# EAGLE design Power (EAGLE 9.1.0)
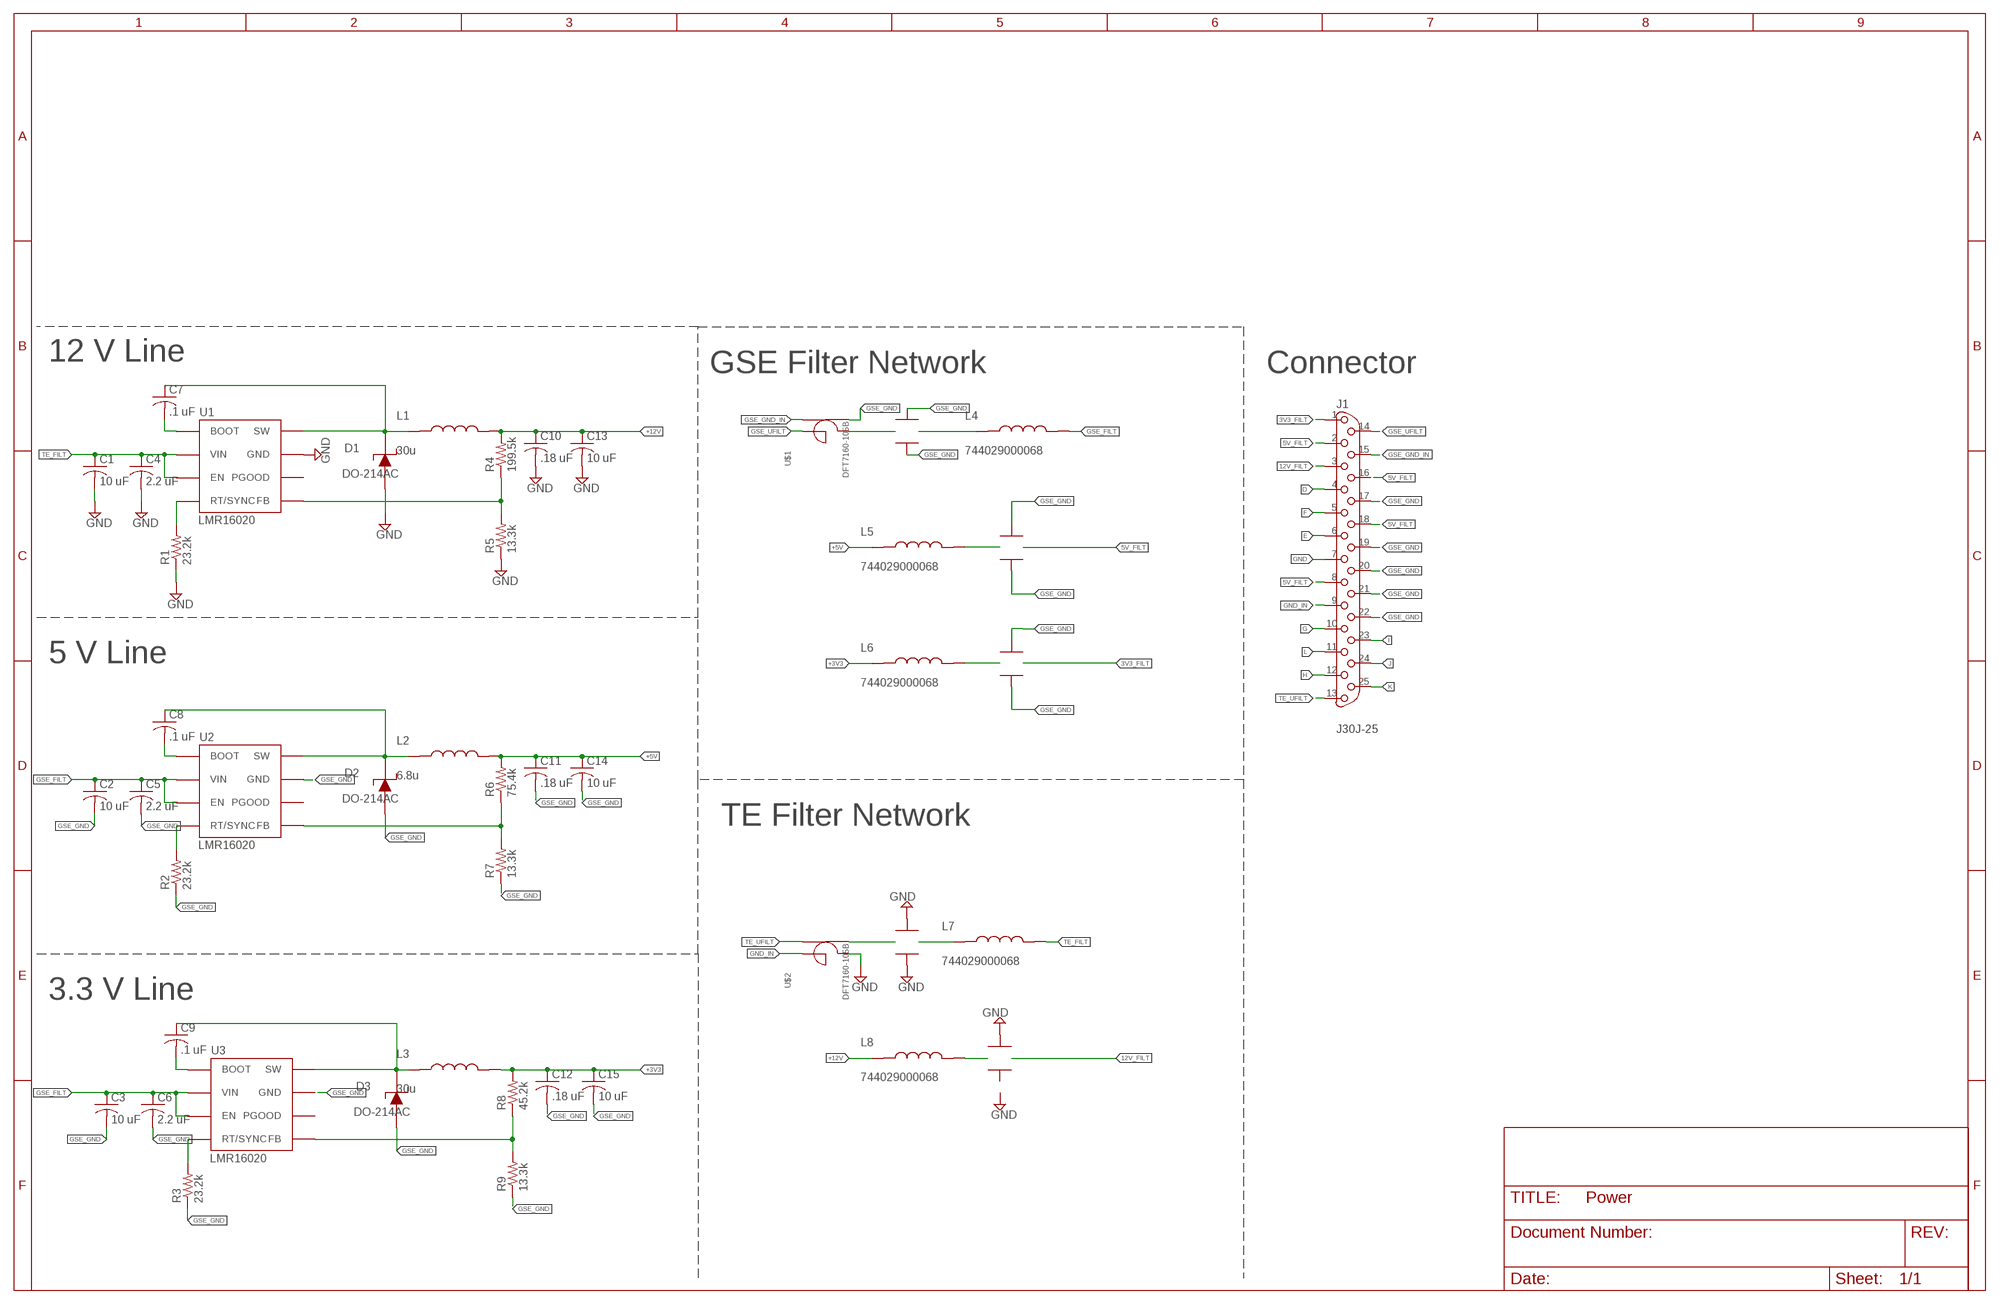
[diagram p0: schematic, sheet 1]

## Parts
C1  10 uF  C-USC1210  [C1210]
C2  10 uF  C-USC1210  [C1210]
C3  10 uF  C-USC1210  [C1210]
C4  2.2 uF  C-USC1210  [C1210]
C5  2.2 uF  C-USC1210  [C1210]
C6  2.2 uF  C-USC1210  [C1210]
C7  .1 uF  C-USC0603  [C0603]
C8  .1 uF  C-USC0603  [C0603]
C9  .1 uF  C-USC0603  [C0603]
C10  .18 uF  C-USC0603  [C0603]
C11  .18 uF  C-USC0603  [C0603]
C12  .18 uF  C-USC0603  [C0603]
C13  10 uF  C-USC0603  [C0603]
C14  10 uF  C-USC0603  [C0603]
C15  10 uF  C-USC0603  [C0603]
D1  DO-214AC  [DO-214AC]
D2  DO-214AC  [DO-214AC]
D3  DO-214AC  [DO-214AC]
J1  J30J-25  [ZKN-25]
L1  30u  744314101  [7050]
L2  6.8u  744314101  [7050]
L3  30u  7443551370  [1365]
L4  744029000068  [2813]
L5  744029000068  [2813]
L6  744029000068  [2813]
L7  744029000068  [2813]
L8  744029000068  [2813]
R1  23.2k  R-US_R0603  [R0603]
R2  23.2k  R-US_R0603  [R0603]
R3  23.2k  R-US_R0603  [R0603]
R4  199.5k  R-US_R0603  [R0603]
R5  13.3k  R-US_R0603  [R0603]
R6  75.4k  R-US_R0603  [R0603]
R7  13.3k  R-US_R0603  [R0603]
R8  45.2k  R-US_R0603  [R0603]
R9  13.3k  R-US_R0603  [R0603]
U1  LMR16020  [SO8]
U2  LMR16020  [SO8]
U3  LMR16020  [SO8]
U$1  DFT7160-105B  [DFT7160]
U$2  DFT7160-105B  [DFT7160]
U$3  1410J0500404MXTE03  [1410]
U$4  1410J0500404MXTE03  [1410]
U$5  1410J0500404MXTE03  [1410]
U$6  1410J0500404MXTE03  [1410]
U$7  1410J0500404MXTE03  [1410]

## Nets
3V3_FILT: J1.1 U$5.P$4
5V_FILT: J1.2 J1.8 J1.16 J1.18 U$4.P$4
12V_FILT: J1.3 U$7.P$4
+3V3: C12.1 C15.1 L3.P$2 L6.P$1 R8.2
+5V: C11.1 C14.1 L2.P$2 L5.P$1 R6.2
+12V: C10.1 C13.1 L1.P$2 L8.P$1 R4.2
D: J1.4
E: J1.6
F: J1.5
G: J1.10
GND: C1.2 C4.2 C10.2 C13.2 D1.P$1 J1.7 R1.1 R5.1 U1.P$7(GND) U1.PAD(GND) U$2.P$4 U$6.P$2 U$6.P$3 U$7.P$3
GND_IN: J1.9 U$2.P$1
GSE_FILT: C2.1 C3.1 C5.1 C6.1 L4.P$2 U2.P$2(VIN) U2.P$3(EN) U3.P$2(VIN) U3.P$3(EN)
GSE_GND: C2.2 C3.2 C5.2 C6.2 C11.2 C12.2 C14.2 C15.2 D2.P$1 D3.P$1 J1.17 J1.19 J1.20 J1.21 J1.22 R2.1 R3.1 R7.1 R9.1 U2.P$7(GND) U2.PAD(GND) U3.P$7(GND) U3.PAD(GND) U$1.P$3 U$3.P$2 U$3.P$3 U$4.P$2 U$4.P$3 U$5.P$2 U$5.P$3
GSE_GND_IN: J1.15 U$1.P$2
GSE_UFILT: J1.14 U$1.P$1
H: J1.12
I: J1.23
J: J1.24
K: J1.25
L: J1.11
N$1: R3.2 U3.P$4(RT/SYNC)
N$2: C9.1 D3.P$2 L3.P$1 U3.P$8(SW)
N$3: R2.2 U2.P$4(RT/SYNC)
N$4: C8.2 U2.P$1(BOOT)
N$5: C8.1 D2.P$2 L2.P$1 U2.P$8(SW)
N$6: C9.2 U3.P$1(BOOT)
N$7: R1.2 U1.P$4(RT/SYNC)
N$8: R8.1 R9.2 U3.P$5(FB)
N$9: R6.1 R7.2 U2.P$5(FB)
N$10: C7.2 U1.P$1(BOOT)
N$14: C7.1 D1.P$2 L1.P$1 U1.P$8(SW)
N$27: R4.1 R5.2 U1.P$5(FB)
N$28: U$1.P$4 U$3.P$4
N$29: U$2.P$3 U$6.P$5
N$31: L4.P$1 U$3.P$5
N$32: L5.P$2 U$4.P$5
N$33: L6.P$2 U$5.P$5
N$34: L7.P$1 U$6.P$4
N$35: L8.P$2 U$7.P$5
TE_FILT: C1.1 C4.1 L7.P$2 U1.P$2(VIN) U1.P$3(EN)
TE_UFILT: J1.13 U$2.P$2
Unconnected: U1.P$6(PGOOD) U2.P$6(PGOOD) U3.P$6(PGOOD) U$7.P$2

## Notes on the sheet
- 12 V Line
- GSE Filter Network | Connector
- 5 V Line
- TE Filter Network
- 3.3 V Line

## Library data of the parts
C1-C15 = resistor:C-US: CAPACITOR, American symbol
D1-D3 = HASP:DO-214AC
J1 = CM_J30J:J30J-25
L1 L2 = Filtering:744314101
L3 = Filtering:7443551370
L4-L8 = Filtering:744029000068
R1-R9 = resistor:R-US_: RESISTOR, American symbol
U1-U3 = HASP:LMR16020
U$1 U$2 = Filtering:DFT7160-105B
U$3-U$7 = Filtering:1410J0500404MXTE03

## Board
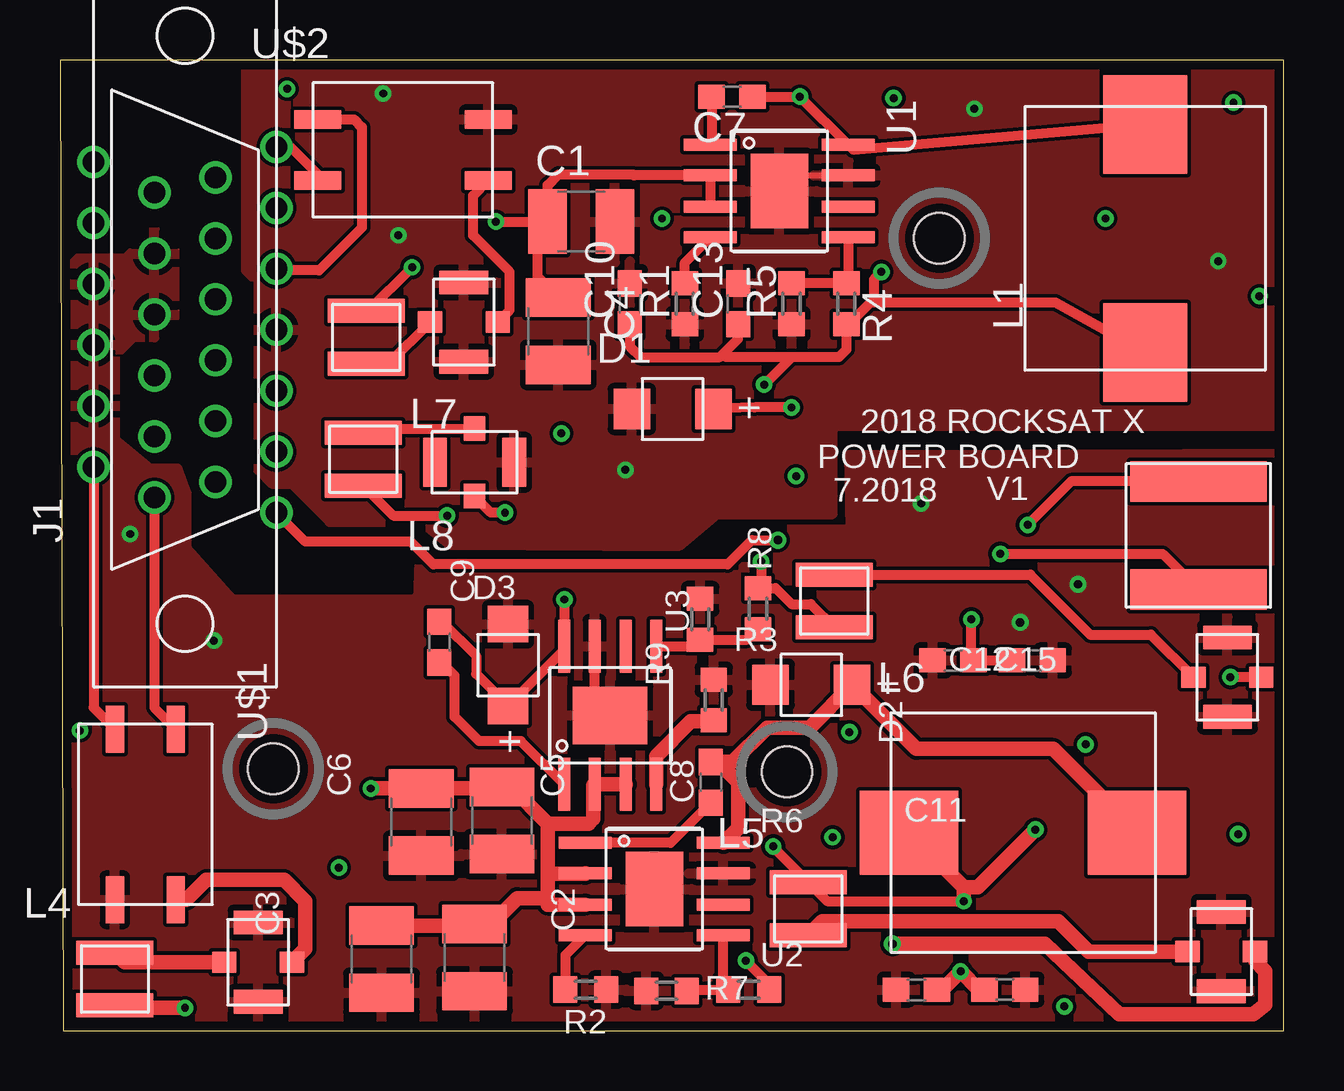
[diagram p1: board, top side]
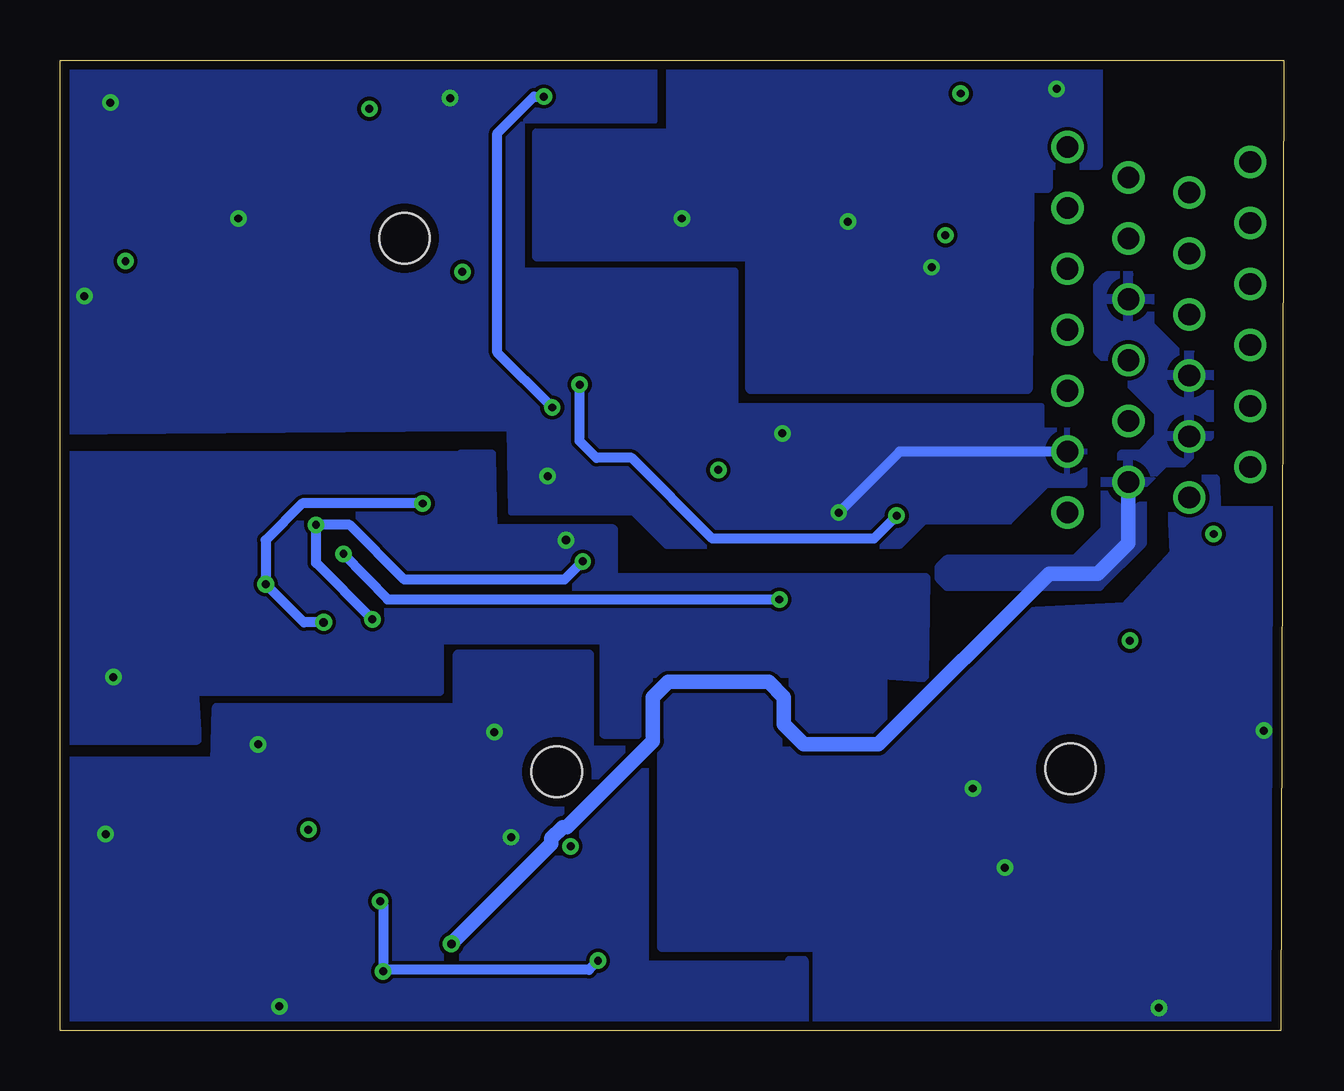
[diagram p2: board, bottom side, seen from below]

Size 50.99 x 40.45 mm. Coordinates in mm from the lower left corner, seen from the top.
Outline: 0.13,0 50.99,0 50.99,40.45 0,40.45 0.13,0
Copper layers (1*16): Top 0.0356mm / dielectric 1.5011mm / Bottom 0.0356mm
Design rules "OshPark *": minimum track width 6mil, minimum drill 13mil, track to track 6mil, track to pad 6mil, pad to pad 6mil, via to via 6mil, smd to smd 6mil, copper to edge 15mil, drill to drill 6mil, minimum pad ring 7mil, minimum via ring 7mil, stop-mask expansion 3mil, vias tented up to drill 25mil, thermal gap 10mil
Holes 2.1 mm at 36.64,33.02 8.89,10.92 30.29,10.79

### Footprints (pad centres in the part's own frame; a part is rotated, then mirrored left to right if it is on the bottom)
C1210 = smd 1.6 x 2.7: 1 -1.4,0; 2 1.4,0
C0603 = smd 1.1 x 1: 1 -0.85,0; 2 0.85,0
DO-214AC = smd 1.524 x 1.676: P$1 -1.702,0; P$2 1.702,0
ZKN-25 = drill 0.9: 1 -7.62,-3.81; 2 -6.35,-1.27; 3 -5.08,-3.81; 4 -3.81,-1.27; 5 -2.54,-3.81; 6 -1.27,-1.27; 7 0,-3.81; 8 1.27,-1.27; 9 2.54,-3.81; 10 3.81,-1.27; 11 5.08,-3.81; 12 6.35,-1.27; 13 7.62,-3.81; 14 -6.985,1.27; 15 -5.715,3.81; 16 -4.445,1.27; 17 -3.175,3.81; 18 -1.905,1.27; 19 -0.635,3.81; 20 0.635,1.27; 21 1.905,3.81; 22 3.175,1.27; 23 4.445,3.81; 24 5.715,1.27; 25 6.985,3.81
7050 = smd 4.1 x 3.5: P$1 4.75,0; P$2 -4.75,0
1365 = smd 1.7 x 5.7: P$1 -2.25,0; P$2 2.25,0
2813 = smd 3.2 x 1: P$1 0,1.1; P$2 0,-1.1
R0603 = smd 1 x 1.1: 1 -0.85,0; 2 0.85,0
SO8 = smd 0.5 x 2.2: P$1 -1.92,-2.875; P$2 -0.65,-2.875; P$3 0.65,-2.875; P$4 1.92,-2.875; P$5 1.92,2.875; P$6 0.65,2.875; P$7 -0.65,2.875; P$8 -1.92,2.875 | smd 3.1 x 2.4: PAD 0,0
DFT7160 = smd 1.956 x 0.762: P$1 -3.556,1.27; P$2 -3.556,-1.27; P$3 3.556,-1.27; P$4 3.556,1.27
1410 = smd 0.991 x 2.032: P$2 1.651,0; P$3 -1.651,0 | smd 0.889 x 1.016: P$4 0,1.41; P$5 0,-1.41

### Placement (x,y rotation side)
C1  21.72,33.72 0 top
C2  17.27,3.05 270 top
C3  13.4,2.98 270 top
C4  20.76,29.15 270 top
C5  15.05,8.7 270 top
C6  18.41,8.76 270 top
C7  28,38.93 180 top
C8  27.11,10.35 270 top
C9  15.81,16.19 270 top
C10  23.75,30.29 90 top
C11  35.69,1.71 180 top
C12  40.51,15.43 0 top
C13  28.26,30.29 90 top
C14  39.37,1.71 0 top
C15  37.21,15.43 180 top
D1  25.53,25.91 0 top
D2  31.31,14.41 0 top
D3  18.67,15.24 270 top
J1  5.21,29.21 90 top
L1  45.21,33.02 90 top
L2  40.13,8.25 0 top
L3  47.43,20.64 90 top
L4  2.29,2.16 0 top
L5  31.18,5.08 0 top
L6  32.26,17.91 180 top
L7  12.76,28.89 180 top
L8  12.64,23.81 180 top
R1  26.04,30.29 90 top
R2  21.91,1.71 180 top
R3  27.24,13.78 270 top
R4  32.77,30.29 270 top
R5  30.48,30.29 90 top
R6  28.7,1.71 0 top
R7  25.27,1.66 0 top
R8  29.08,17.59 90 top
R9  26.67,17.14 270 top
U1  29.97,34.99 270 top
U2  24.77,5.91 270 top
U3  22.92,13.14 0 top
U$1  3.56,9.02 270 top
U$2  14.29,36.7 0 top
U$3  8.26,2.86 270 top
U$4  48.39,3.3 270 top
U$5  48.64,14.73 270 top
U$6  16.83,29.53 90 top
U$7  17.27,23.69 180 top

### Tracks (layer width: path | path; a pad name or v marks a point on that pad's centre or on a via)
3V3_FILT  (via drill 0.33, 0.35)
  Top 0.406: J1.1 10.22,20.38 14.61,20.38 15.56,19.43 27.81,19.43 28.83,20.45 v29.91,20.45 | U$5.P$4 v48.77,14.73
  pour Bottom: 52.01,12.13 45.28,12.13 45.4,14.16 35.18,14.16 35.18,16.32 28.32,16.32 28.32,12.38 26.48,12.38 26.48,14.92 20.45,14.92 20.45,12.38 16.7,12.38 16.7,14.86 14.99,14.73 14.92,18.86 27.94,18.86 27.94,20.89 32.96,20.89 33.02,24 34.29,24 34.23,23.94 52.32,23.94
5V_FILT  (via drill 0.35)
  Top 0.61: U$4.P$4 49.8,2.91 50.23,2.48 50.23,1.08 49.72,0.7 44.13,0.7 41.03,3.62 v34.68,3.62
  Bottom 0.61: v34.68,3.62 30.52,7.78 30.52,8.02 30.05,8.48 29.87,8.48 26.29,12.06 26.29,13.91 25.65,14.54 21.46,14.54 20.83,13.91 20.83,12.76 20,11.94 16.89,11.94 9.78,19.05 7.75,19.05 6.48,20.32 J1.2
  pour Bottom: 13.97,18.54 7.68,18.54 5.91,20.32 5.91,22.73 4.95,23.69 4.19,23.69 3.11,24.77 3.11,27.69 3.56,28.13 4.32,28.13 5.59,29.4 5.59,31.12 5.91,31.43 7.37,31.43 7.75,31.05 7.75,28.32 5.21,25.78 5.21,24.77 5.97,24 6.73,24 7.43,23.3 7.43,20.89 8.7,19.62 14.03,19.62 14.35,19.3 14.35,18.86 14.03,18.54
12V_FILT  (via drill 0.33, 0.33 pad 0.33)
  Top 0.406: v18.54,21.59 17.96,21.59 U$7.P$4
  Bottom 0.406: J1.3 16,24.13 v18.54,21.59
  other vias: 20.89,24.89 30.67,23.11 34.73,38.86 48.89,38.67 49.97,30.61 43.56,33.85
  pour Bottom: 26.23,40.96 26.23,37.91 31.75,37.91 31.75,31.69 22.86,31.69 22.86,26.03 10.1,26.03 10.1,25.02 8.32,25.02 8.32,22.73 9.91,22.73 11.43,21.21 14.99,21.21 16,20.19 25.72,20.19 27.11,21.59 32.19,21.59 32.26,25.08 34.1,25.08 49.09,24.96 53.47,24.96 53.4,40.96
+3V3  (via drill 0.33, 0.33 pad 0.33)
  Top 0.406: v29.21,19.56 29.21,18.57 R8.2 29.82,18.44 30.48,17.78 31.29,17.78 L6.P$1 | C12.1 C15.1 37.97,15.52 v37.97,17.14 | L3.P$2 42.13,22.89 v40.32,21.08
  Bottom 0.406: v37.97,17.14 40.32,19.49 v40.32,21.08 38.93,21.08 36.64,18.8 29.97,18.8 v29.21,19.56
+5V  (via drill 0.33, 0.33 pad 0.33)
  Top 0.406: R6.2 29.55,1.94 v28.57,2.92 | v29.72,7.68 29.87,7.49 L5.P$1 31.96,5.4 v37.66,5.4
  Top 0.61: L2.P$2 37.66,5.98 | 37.66,5.98 v37.66,5.4 | v40.64,8.38 38.24,5.98 37.66,5.98 | C14.1 38.29,1.71 v37.53,2.48 36.77,1.71 C11.1
  Bottom 0.406: v37.66,5.4 37.53,5.27 37.53,2.54 | 37.53,2.54 v37.53,2.48 | v28.57,2.92 28.96,2.54 37.53,2.54
+5V_FILT  (via drill 0.33 pad 0.33)
  other vias: 32.89,12.45 32.19,8.06 42.74,11.94 49.09,8.19 41.85,1.02
  pour Bottom: 20,2.92 20,-2.86 52.51,-2.86 52.58,11.24 44.51,11.24 44.45,13.46 34.42,13.46 34.42,15.68 28.96,15.68 28.96,11.68 26.67,11.68 26.67,2.73 20.57,2.73 20.57,2.92
+12V  (via drill 0.33, 0.33 pad 0.33)
  Top 0.406: C10.1 23.75,28.51 24.19,28.07 27.5,28.07 27.62,28.19 | 27.62,28.19 28.26,28.83 C13.1 | 30.48,28.07 32.45,28.07 32.77,28.38 R4.2 32.87,29.44 33.78,30.35 33.91,30.35 | 30.48,28.07 27.75,28.07 27.62,28.19 | 33.91,30.35 41.47,30.35 L1.P$2 | L8.P$1 13.89,21.46 v16.13,21.46 | v34.23,31.62 33.91,31.31 33.91,30.35 | v29.34,26.92 30.48,28.07
  Bottom 0.406: v16.13,21.46 17.08,20.51 23.81,20.51 27.18,23.88 28.64,23.88 29.34,24.57 v29.34,26.92
GND  (via drill 0.33 pad 0.33)
  Top 0.254: U1.PAD 30.62,35.64 U1.P$7
  other vias: 13.46,39.05 14.1,33.15 23.56,23.37 38.1,38.42 48.26,32.07
  pour Top: 7.75,41.91 7.75,31.69 8.26,31.18 8.26,23.37 8.83,22.8 9.65,22.8 11.24,21.21 15.05,21.21 16.26,20.26 25.78,20.19 27.37,21.53 32.19,21.53 32.19,25.21 52.2,25.21 52.2,41.91
GND_IN
  Top 0.406: U$2.P$1 12.26,37.97 12.57,37.66 12.57,33.46 10.79,31.69 9.08,31.69 J1.9
GSE_FILT  (via drill 0.33, 0.33 pad 0.33)
  Top 0.61: 20.32,8.64 18.79,10.16 C6.1 18.35,10.1 C5.1 v12.95,10.1 | 20.32,8.64 22.03,8.64 22.23,8.83 22.23,10.22 U3.P$2 U3.P$3 | U2.P$3 20.32,5.25 20.32,5.52 | 20.32,8.64 20.32,6.54 | 20.32,6.54 20.32,5.52 | U2.P$2 21.88,6.54 20.32,6.54 | 20.32,5.52 19.05,5.52 17.97,4.45 C2.1 17.21,4.38 C3.1 | v5.21,0.95 2.39,0.95 L4.P$2
  other vias: 0.83,12.51 11.62,6.79
  pour Bottom: 2.86,22.99 4.7,22.92 4.57,19.88 6.6,17.65 14.1,17.27 14.35,17.27 14.35,14.16 16.13,14.16 16.13,14.16 16.13,11.62 21.08,11.62 21.08,14.29 25.91,14.29 25.91,3.49 19.43,3.49 19.43,-1.52 -0.13,-1.52 0.06,21.65 2.79,21.65
GSE_GND  (via drill 0.33, 0.35)
  Top 0.406: U3.PAD 22.27,13.79 U3.P$7
  Bottom 0.406: v40,17.02 40.83,17.02 v42.42,18.61 42.42,20.45 40.89,21.97 v35.88,21.97
  other vias: 2.92,20.7 6.41,16.26
  pour Top: 4.76,33.02 4.76,29.72 3.94,28.89 3.05,28.89 2.29,28.13 2.29,24.64 3.75,23.43 4.89,23.43 5.27,22.42 5.27,20.13 7.18,17.97 14.92,17.97 14.99,19.56 27.88,19.56 27.94,20.89 32.96,20.89 32.89,24 53.72,24.07 53.66,-5.14 -0.95,-1.33 -0.95,30.48 0.76,32.19 2.73,32.19 3.24,32.7 3.24,33.27 4.51,33.27
GSE_GND_IN
  Top 0.406: J1.15 1.4,13.46 U$1.P$2
GSE_UFILT
  Top 0.406: J1.14 3.94,13.46 U$1.P$1
N$1
  Top 0.61: U3.P$4 24.84,11.45 26.29,12.89 27.2,12.89 R3.2
N$2  (via drill 0.33)
  Top 0.406: v21.02,17.97 21,18.02 U3.P$8 21,15.87 D3.P$2 17.34,14.87 17.34,15.62 15.91,17.04 C9.1 | v39.18,19.88 45.95,19.88 L3.P$1
  Bottom 0.406: v39.18,19.88 37.34,17.97 v21.02,17.97
N$3
  Top 0.406: U2.P$4 21.06,3.15 R2.2
N$4
  Top 0.406: C8.2 25.44,7.83 U2.P$1
N$5
  Top 0.61: U2.P$8 28.26,8.44 28.26,10.35 27.41,11.2 C8.1 28.03,11.2 29.46,12.64 31.23,12.64 D2.P$2 33.02,14.41 35.69,11.75 41.39,11.75 L2.P$1
N$6
  Top 0.406: U3.P$1 19.21,12.06 17.46,12.06 16.45,13.08 16.45,14.79 15.9,15.34 C9.2
N$7
  Top 0.406: R1.2 26.04,32.01 U1.P$4
N$8
  Top 0.406: U3.P$5 26.39,16.02 R9.2 28.64,16.3 R8.1
N$9
  Top 0.406: R7.2 26.17,1.71 R6.1 27.64,1.93 U2.P$5
N$10
  Top 0.406: C7.2 27.15,36.96 U1.P$1
N$14  (via drill 0.33)
  Top 0.406: C7.1 v30.83,38.93 U1.P$8 33.04,36.71 L1.P$1 | v30.48,25.97 28.94,25.97 D1.P$2
  Bottom 0.406: v30.48,25.97 32.77,28.26 32.77,37.4 31.24,38.93 v30.83,38.93
N$27
  Top 0.406: U1.P$5 32.85,31.22 R4.1 R5.2
N$28
  Top 0.61: U$1.P$4 5.27,5.46 6.1,6.29 9.33,6.29 10.22,5.4 10.22,3.42 U$3.P$4
N$29
  Top 0.406: U$6.P$5 18.73,30.02 18.73,31.62 17.21,33.15 17.21,34.8 U$2.P$3
N$31
  Top 0.61: U$3.P$5 2.69,2.86 L4.P$1
N$32
  Top 0.61: U$4.P$5 42.86,3.3 41.59,4.57 31.77,4.57 L5.P$2
N$33
  Top 0.406: L6.P$2 40.43,19.01 42.93,16.51 45.45,16.51 U$5.P$5
N$34
  Top 0.406: U$6.P$4 13.68,27.79 L7.P$1
N$35
  Top 0.406: L8.P$2 12.82,25.09 U$7.P$5
TE_FILT  (via drill 0.33 pad 0.33)
  Top 0.406: U1.P$3 U1.P$2 23.93,35.64 23.88,35.69 20.76,35.69 20.32,35.24 C1.1 | C4.1 19.9,31.41 19.9,33.3 C1.1 | v18.16,33.72 C1.1 | L7.P$2 12.85,29.99 v14.67,31.81
  other vias: 9.46,39.24 25.08,33.85
  pour Bottom: 7.75,40.64 7.75,36.07 9.84,36.07 9.84,35.12 10.6,35.12 10.67,26.73 22.23,26.73 22.23,32.26 31.12,32.26 31.12,37.4 25.53,37.4 25.53,40.7
TE_UFILT
  Top 0.406: J1.13 9.59,36.83 10.73,35.69 U$2.P$2

### Text on the board
tPlace: 2018 ROCKSAT X | POWER BOARD | 7.2018 | V1